# EAGLE schematic gvs1 (EAGLE 6.4)
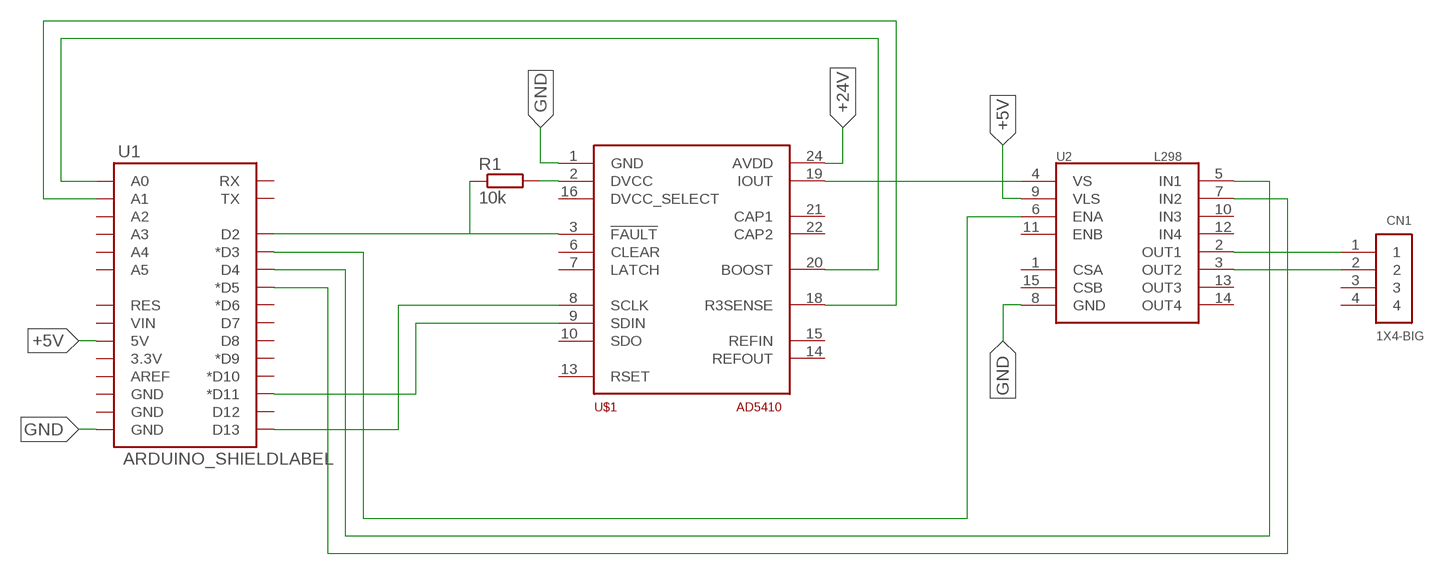
[diagram p0: schematic, sheet 1]

## Parts
CN1  1X4-BIG  [1X04-BIG]
R1  10k  R-EU_0204/2V  [0204V]
U1  ARDUINO_SHIELDLABEL  [DUEMILANOVE_SHIELD]
U2  L298  [MULTIWATT15]
U$1  AD5410  [TSSOP24]

## Nets
+5V: U1.5V U2.9(VLS)
+24V: U$1.24(AVDD)
GND: U1.GND@0(GND) U2.8(GND) U$1.1(GND)
N$1: U1.D11(*D11) U$1.9(SDIN)
N$2: U1.D13 U$1.8(SCLK)
N$3: U2.4(VS) U$1.19(IOUT)
N$4: U1.D3(*D3) U2.6(ENA)
N$5: U1.A0 U$1.20(BOOST)
N$6: R1.2 U$1.2(DVCC)
N$7: U1.A1 U$1.18(R3SENSE)
N$8: R1.1 U1.D2 U$1.3(!FAULT!)
N$9: CN1.1 U2.2(OUT1)
N$10: CN1.2 U2.3(OUT2)
N$11: U1.D5(*D5) U2.7(IN2)
N$12: U1.D4 U2.5(IN1)
Unconnected: CN1.3 CN1.4 U1.3.3V U1.A2 U1.A3 U1.A4 U1.A5 U1.AREF U1.D6(*D6) U1.D7 U1.D8 U1.D9(*D9) U1.D10(*D10) U1.D12 U1.GND@1(GND) U1.GND@2(GND) U1.RES U1.RX U1.TX U1.VIN U2.1(CSA) U2.10(IN3) U2.11(ENB) U2.12(IN4) U2.13(OUT3) U2.14(OUT4) U2.15(CSB) U$1.6(CLEAR) U$1.7(LATCH) U$1.10(SDO) U$1.13(RSET) U$1.14(REFOUT) U$1.15(REFIN) U$1.16(DVCC_SELECT) U$1.21(CAP1) U$1.22(CAP2)

## Library data of the parts
CN1 = adafruit:1X4: 4-pin connector
R1 = resistor:R-EU_: RESISTOR, European symbol
U1 = SparkFun-Boards:ARDUINO_SHIELD: Arduino shield footprint
U2 = SparkFun-PowerIC:L298: L298 Dual Full Bridge Driver
U$1 = custom_components:AD5410